# Altium schematic sheet Z7_FUNCTION2.SchDoc
size A3
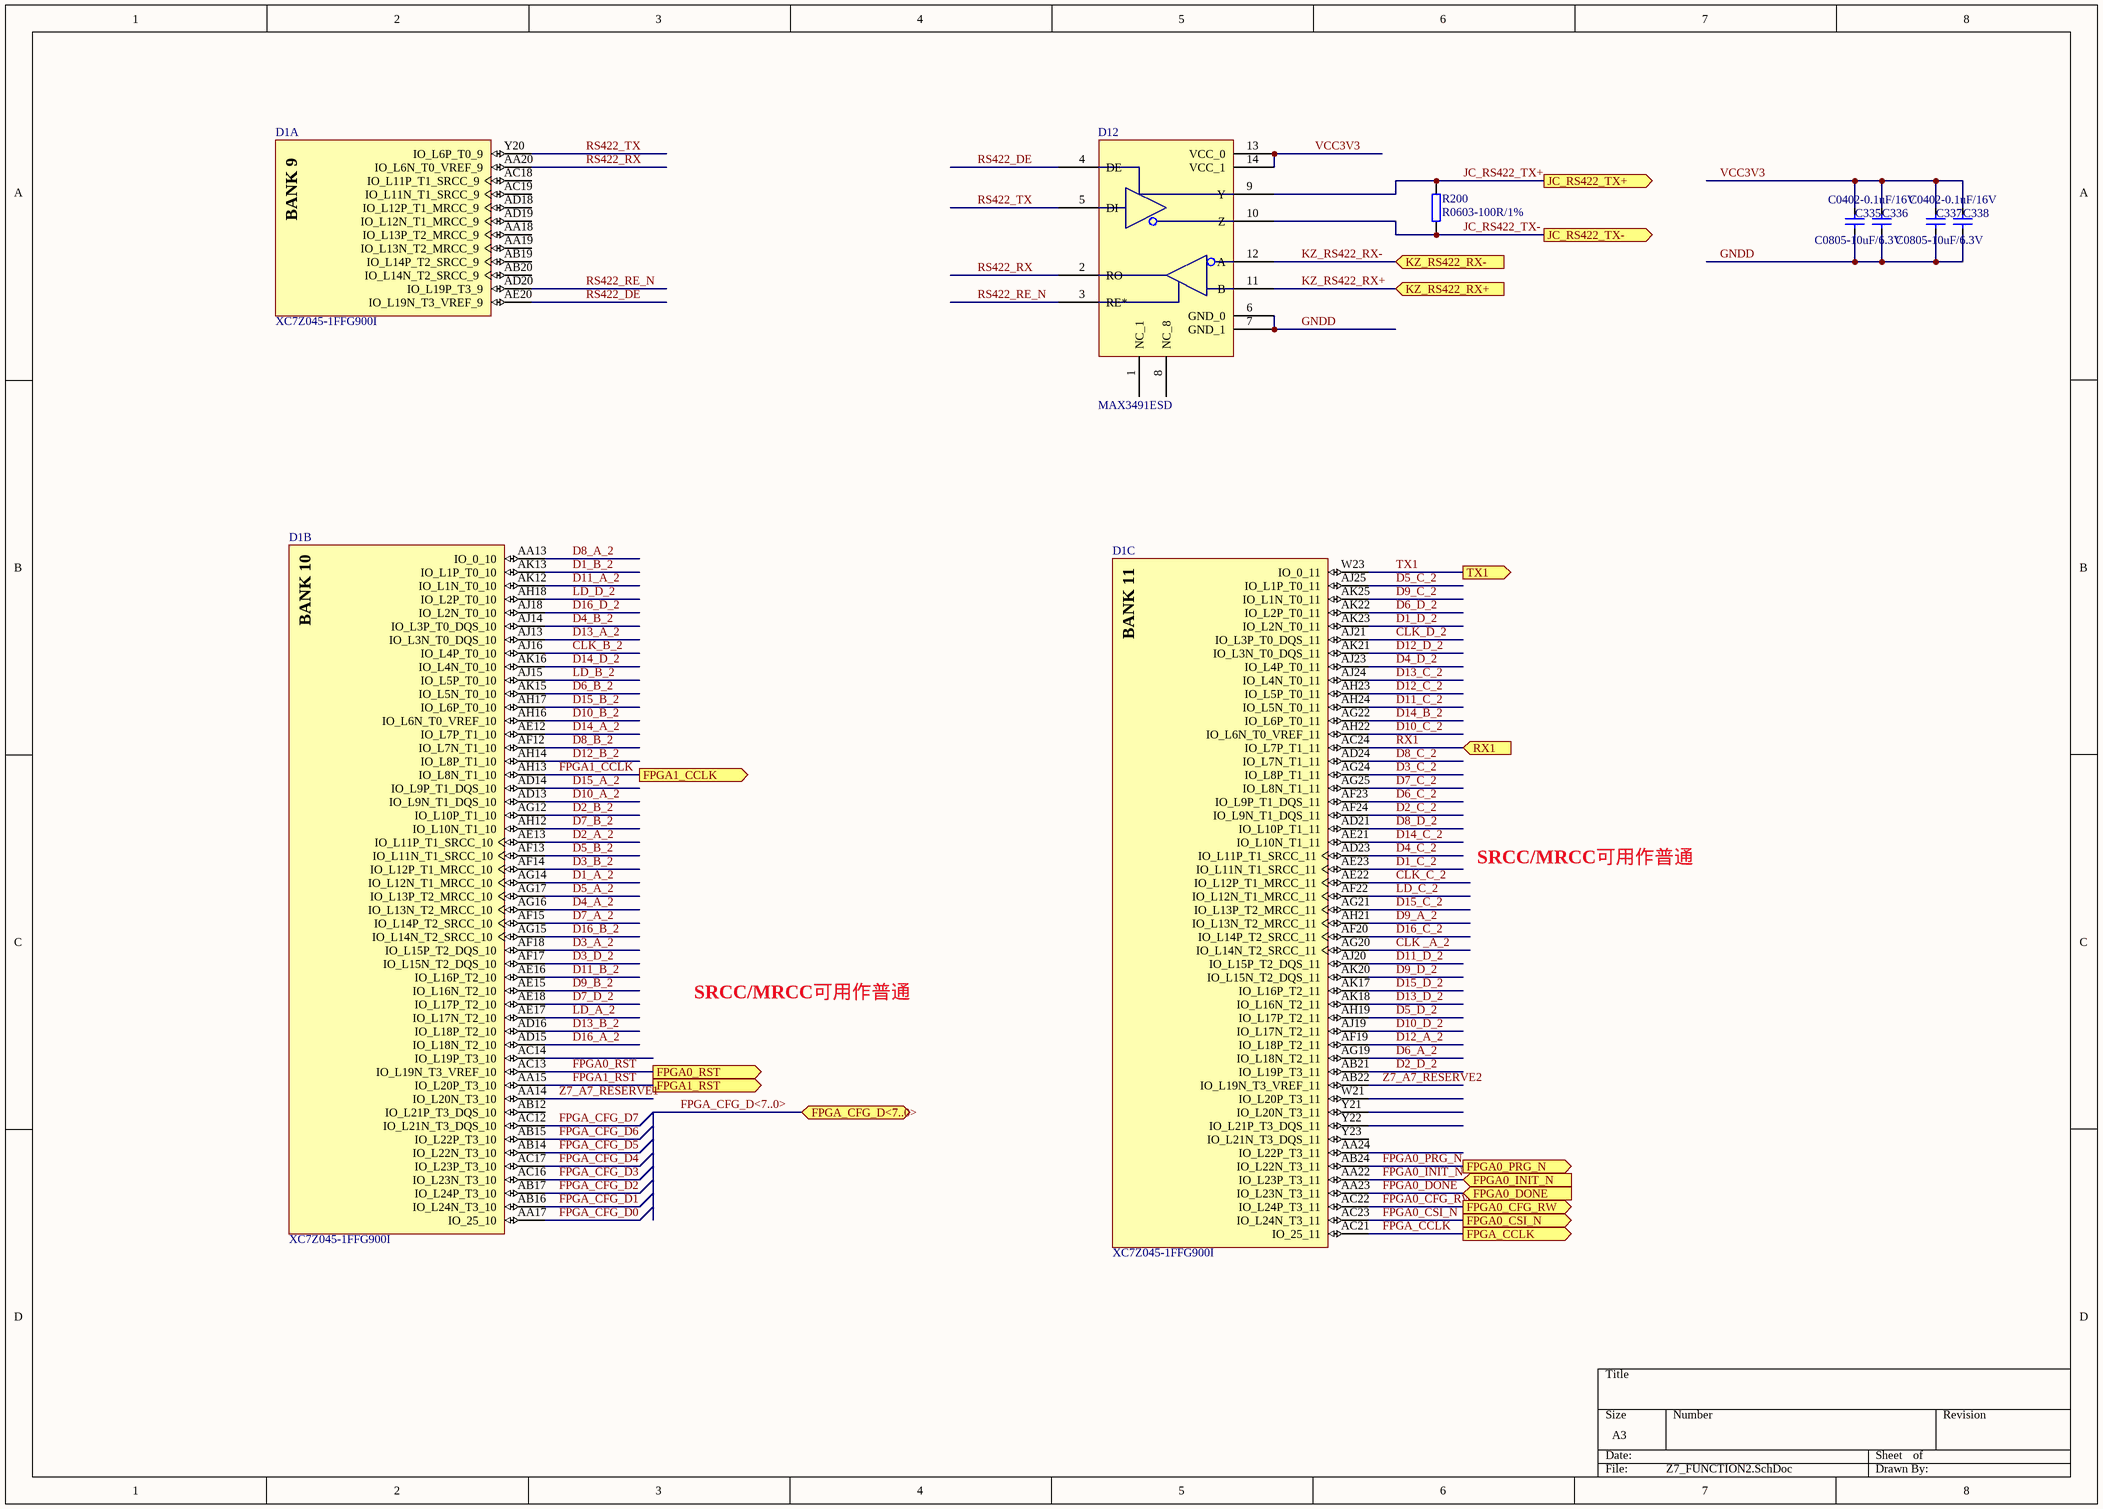
[diagram p0: Z7_FUNCTION2.SchDoc]

## Parts
C335  C0805-10uF/6.3V  [C0805]
C336  C0402-0.1uF/16V  [C0402]
C337  C0805-10uF/6.3V  [C0805]
C338  C0402-0.1uF/16V  [C0402]
D1  XC7Z045-1FFG900I  [FFG900]  (parts A,B,C of 16)
D12  MAX3491ESD  [SO-14]
R200  R0603-100R/1%  [R0603]

## Ports
FPGA0_CFG_RW (out), FPGA0_CSI_N (out), FPGA0_DONE (in), FPGA0_INIT_N (in), FPGA0_PRG_N (out), FPGA0_RST (out), FPGA1_CCLK (out), FPGA1_RST (out), FPGA_CCLK (out), FPGA_CFG_D<7..0> (bidir), JC_RS422_TX+ (out), JC_RS422_TX- (out), KZ_RS422_RX+ (in), KZ_RS422_RX- (in), RX1 (in), TX1 (out)

## Nets
CLK _A_2: D1.AG20(IO_L14N_T2_SRCC_11)
CLK_B_2: D1.AJ16(IO_L4P_T0_10)
CLK_C_2: D1.AE22(IO_L12P_T1_MRCC_11)
CLK_D_2: D1.AJ21(IO_L3P_T0_DQS_11)
D1_A_2: D1.AG14(IO_L12N_T1_MRCC_10)
D1_B_2: D1.AK13(IO_L1P_T0_10)
D1_C_2: D1.AE23(IO_L11N_T1_SRCC_11)
D1_D_2: D1.AK23(IO_L2N_T0_11)
D2_A_2: D1.AE13(IO_L11P_T1_SRCC_10)
D2_B_2: D1.AG12(IO_L10P_T1_10)
D2_C_2: D1.AF24(IO_L9N_T1_DQS_11)
D2_D_2: D1.AB21(IO_L19P_T3_11)
D3_A_2: D1.AF18(IO_L15P_T2_DQS_10)
D3_B_2: D1.AF14(IO_L12P_T1_MRCC_10)
D3_C_2: D1.AG24(IO_L8P_T1_11)
D3_D_2: D1.AF17(IO_L15N_T2_DQS_10)
D4_A_2: D1.AG16(IO_L13N_T2_MRCC_10)
D4_B_2: D1.AJ14(IO_L3P_T0_DQS_10)
D4_C_2: D1.AD23(IO_L11P_T1_SRCC_11)
D4_D_2: D1.AJ23(IO_L4P_T0_11)
D5_A_2: D1.AG17(IO_L13P_T2_MRCC_10)
D5_B_2: D1.AF13(IO_L11N_T1_SRCC_10)
D5_C_2: D1.AJ25(IO_L1P_T0_11)
D5_D_2: D1.AH19(IO_L17P_T2_11)
D6_A_2: D1.AG19(IO_L18N_T2_11)
D6_B_2: D1.AK15(IO_L5N_T0_10)
D6_C_2: D1.AF23(IO_L9P_T1_DQS_11)
D6_D_2: D1.AK22(IO_L2P_T0_11)
D7_A_2: D1.AF15(IO_L14P_T2_SRCC_10)
D7_B_2: D1.AH12(IO_L10N_T1_10)
D7_C_2: D1.AG25(IO_L8N_T1_11)
D7_D_2: D1.AE18(IO_L17P_T2_10)
D8_A_2: D1.AA13(IO_0_10)
D8_B_2: D1.AF12(IO_L7N_T1_10)
D8_C_2: D1.AD24(IO_L7N_T1_11)
D8_D_2: D1.AD21(IO_L10P_T1_11)
D9_A_2: D1.AH21(IO_L13N_T2_MRCC_11)
D9_B_2: D1.AE15(IO_L16N_T2_10)
D9_C_2: D1.AK25(IO_L1N_T0_11)
D9_D_2: D1.AK20(IO_L15N_T2_DQS_11)
D10_A_2: D1.AD13(IO_L9N_T1_DQS_10)
D10_B_2: D1.AH16(IO_L6N_T0_VREF_10)
D10_C_2: D1.AH22(IO_L6N_T0_VREF_11)
D10_D_2: D1.AJ19(IO_L17N_T2_11)
D11_A_2: D1.AK12(IO_L1N_T0_10)
D11_B_2: D1.AE16(IO_L16P_T2_10)
D11_C_2: D1.AH24(IO_L5N_T0_11)
D11_D_2: D1.AJ20(IO_L15P_T2_DQS_11)
D12_A_2: D1.AF19(IO_L18P_T2_11)
D12_B_2: D1.AH14(IO_L8P_T1_10)
D12_C_2: D1.AH23(IO_L5P_T0_11)
D12_D_2: D1.AK21(IO_L3N_T0_DQS_11)
D13_A_2: D1.AJ13(IO_L3N_T0_DQS_10)
D13_B_2: D1.AD16(IO_L18P_T2_10)
D13_C_2: D1.AJ24(IO_L4N_T0_11)
D13_D_2: D1.AK18(IO_L16N_T2_11)
D14_A_2: D1.AE12(IO_L7P_T1_10)
D14_B_2: D1.AG22(IO_L6P_T0_11)
D14_C_2: D1.AE21(IO_L10N_T1_11)
D14_D_2: D1.AK16(IO_L4N_T0_10)
D15_A_2: D1.AD14(IO_L9P_T1_DQS_10)
D15_B_2: D1.AH17(IO_L6P_T0_10)
D15_C_2: D1.AG21(IO_L13P_T2_MRCC_11)
D15_D_2: D1.AK17(IO_L16P_T2_11)
D16_A_2: D1.AD15(IO_L18N_T2_10)
D16_B_2: D1.AG15(IO_L14N_T2_SRCC_10)
D16_C_2: D1.AF20(IO_L14P_T2_SRCC_11)
D16_D_2: D1.AJ18(IO_L2N_T0_10)
FPGA0_CFG_RW: D1.AC22(IO_L24P_T3_11) ; port FPGA0_CFG_RW
FPGA0_CSI_N: D1.AC23(IO_L24N_T3_11) ; port FPGA0_CSI_N
FPGA0_DONE: D1.AA23(IO_L23N_T3_11) ; port FPGA0_DONE
FPGA0_INIT_N: D1.AA22(IO_L23P_T3_11) ; port FPGA0_INIT_N
FPGA0_PRG_N: D1.AB24(IO_L22N_T3_11) ; port FPGA0_PRG_N
FPGA0_RST: D1.AC13(IO_L19N_T3_VREF_10) ; port FPGA0_RST
FPGA1_CCLK: D1.AH13(IO_L8N_T1_10) ; port FPGA1_CCLK
FPGA1_RST: D1.AA15(IO_L20P_T3_10) ; port FPGA1_RST
FPGA_CCLK: D1.AC21(IO_25_11) ; port FPGA_CCLK
FPGA_CFG_D0: D1.AA17(IO_25_10)
FPGA_CFG_D1: D1.AB16(IO_L24N_T3_10)
FPGA_CFG_D2: D1.AB17(IO_L24P_T3_10)
FPGA_CFG_D3: D1.AC16(IO_L23N_T3_10)
FPGA_CFG_D4: D1.AC17(IO_L23P_T3_10)
FPGA_CFG_D5: D1.AB14(IO_L22N_T3_10)
FPGA_CFG_D6: D1.AB15(IO_L22P_T3_10)
FPGA_CFG_D7: D1.AC12(IO_L21N_T3_DQS_10)
GNDD: C335.2 C336.2 C337.2 C338.2 D12.6(GND_0) D12.7(GND_1)
JC_RS422_TX+: D12.9(Y) R200.2 ; port JC_RS422_TX+
JC_RS422_TX-: D12.10(Z) R200.1 ; port JC_RS422_TX-
KZ_RS422_RX+: D12.11(B) ; port KZ_RS422_RX+
KZ_RS422_RX-: D12.12(A) ; port KZ_RS422_RX-
LD_A_2: D1.AE17(IO_L17N_T2_10)
LD_B_2: D1.AJ15(IO_L5P_T0_10)
LD_C_2: D1.AF22(IO_L12N_T1_MRCC_11)
LD_D_2: D1.AH18(IO_L2P_T0_10)
RS422_DE: D1.AE20(IO_L19N_T3_VREF_9) D12.4(DE)
RS422_RE_N: D1.AD20(IO_L19P_T3_9) D12.3(RE*)
RS422_RX: D1.AA20(IO_L6N_T0_VREF_9) D12.2(RO)
RS422_TX: D1.Y20(IO_L6P_T0_9) D12.5(DI)
RX1: D1.AC24(IO_L7P_T1_11) ; port RX1
TX1: D1.W23(IO_0_11) ; port TX1
VCC3V3: C335.1 C336.1 C337.1 C338.1 D12.13(VCC_0) D12.14(VCC_1)
Z7_A7_RESERVE1: D1.AA14(IO_L20N_T3_10)
Z7_A7_RESERVE2: D1.AB22(IO_L19N_T3_VREF_11)

Not connected (* = marked no-connect by the designer): D1 AA18(IO_L13P_T2_MRCC_9) AA19(IO_L13N_T2_MRCC_9) AA24(IO_L22P_T3_11) AB12(IO_L21P_T3_DQS_10) AB19(IO_L14P_T2_SRCC_9) AB20(IO_L14N_T2_SRCC_9) AC14(IO_L19P_T3_10) AC18(IO_L11P_T1_SRCC_9) AC19(IO_L11N_T1_SRCC_9) AD18(IO_L12P_T1_MRCC_9) AD19(IO_L12N_T1_MRCC_9) W21(IO_L20P_T3_11) Y21(IO_L20N_T3_11) Y22(IO_L21P_T3_DQS_11) Y23(IO_L21N_T3_DQS_11); D12 1(NC_1) 8(NC_8)

## Buses and harness runs
bus FPGA_CFG_D<7..0> = port FPGA_CFG_D<7..0>

## Notes on the sheet
- SRCC/MRCC可用作普通
- (in symbol XC7Z045-1FFG900I, part A) BANK 9
- (in symbol XC7Z045-1FFG900I, part B) BANK 10
- (in symbol XC7Z045-1FFG900I, part C) BANK 11

## Library data of the parts
C335 C337 = C1210-22uF/16V: Part_number: C0805-10uF/6.3V; Part_type: CAP; Value: C0805-10uF/6.3V; Schematic_Part: CAP; PCB_Footprint: C0805
C336 C338 = C0402-0.1uF/16V: X7R; Manufacturer: SAMSUNG; Manufacturer_p/n: CL05X7R104KO5NNN; Part_number: C0402-0.1uF/16V; Part_type: CAP; Value: C0402-0.1uF/16V; temperature: -55℃\+125℃; Schematic_Part: CAP; PCB_Footprint: C0402; datasheet: #DataSheet\C_Samsung_General Capacitors.pdf#
D1 = XC7Z045-1FFG900I: 667 MHz Zynq?7000 AP SoC, 130 PS I/O, 378 FPGA I/O, 900-Ball BGA, Speed Grade 1, Industrial Grade, Pb-Free; Manufacturer: Xilinx; Extensible Block RAM (# 36Kb Blocks): 2180 KB (545); Flip Flops: 437200; LUTs: 218600; Speed Grade: -1; DatasheetVersion: v1.2; PackageVersion: Rev 1.1; PackageReference: FFG900; PackageDescription: Flip-Chip BGA, Body 31 x 31 mm, 1.0 mm Pitch; Generic Part Number: XC7Z045; RoHS: Pb-Free; Mounting Technology: Surface Mount; Code_JEDEC: MS-034-AAN-1; PartNumber: XC7Z045-1FFG900I; ComponentLink1Description: Datasheet; ComponentLink1URL: http://www.xilinx.com/support/documentation/data_sheets/ds190-Zynq-7000-Overview.pdf; ComponentLink2Description: Package Specification; ComponentLink2URL: http://www.xilinx.com/support/documentation/user_guides/ug865-Zynq-7000-Pkg-Pinout.pdf; ComponentLink3Description: DC and AC Switching Characteristics; ComponentLink3URL: http://www.xilinx.com/support/documentation/data_sheets/ds191-XC7Z030-XC7Z045-data-sheet.pdf; ComponentLink4Description: Package File; ComponentLink4URL: http://www.xilinx.com/support/packagefiles/z7packages/xc7z045ffg900pkg.txt; ComponentLink5Description: Packaging and Pinout; ComponentLink5URL: http://www.xilinx.com/support/documentation/user_guides/ug865-Zynq-7000-Pkg-Pinout.pdf; ComponentLink6Description: PCB and Layout Guide; ComponentLink6URL: http://www.xilinx.com/support/documentation/user_guides/ug483_7Series_PCB.pdf
R200 = R0603-100R/1%: Manufacturer: YAGEO; Manufacturer_p/n: RC0603FR-07100R; Part_number: R0603-100R/1%; Part_type: RES; Value: R0603-100R/1%; Schematic_Part: RES; PCB_Footprint: R0603; Manufacturer_p/n2: SAMSUNG; datasheet: Datasheet\R_YAGEO#Datasheet\R_YAGEO#
D12 = MAX3491ESD: Part_number: MAX3491ESD